# EAGLE design Version1.2 (EAGLE 9.6.2)
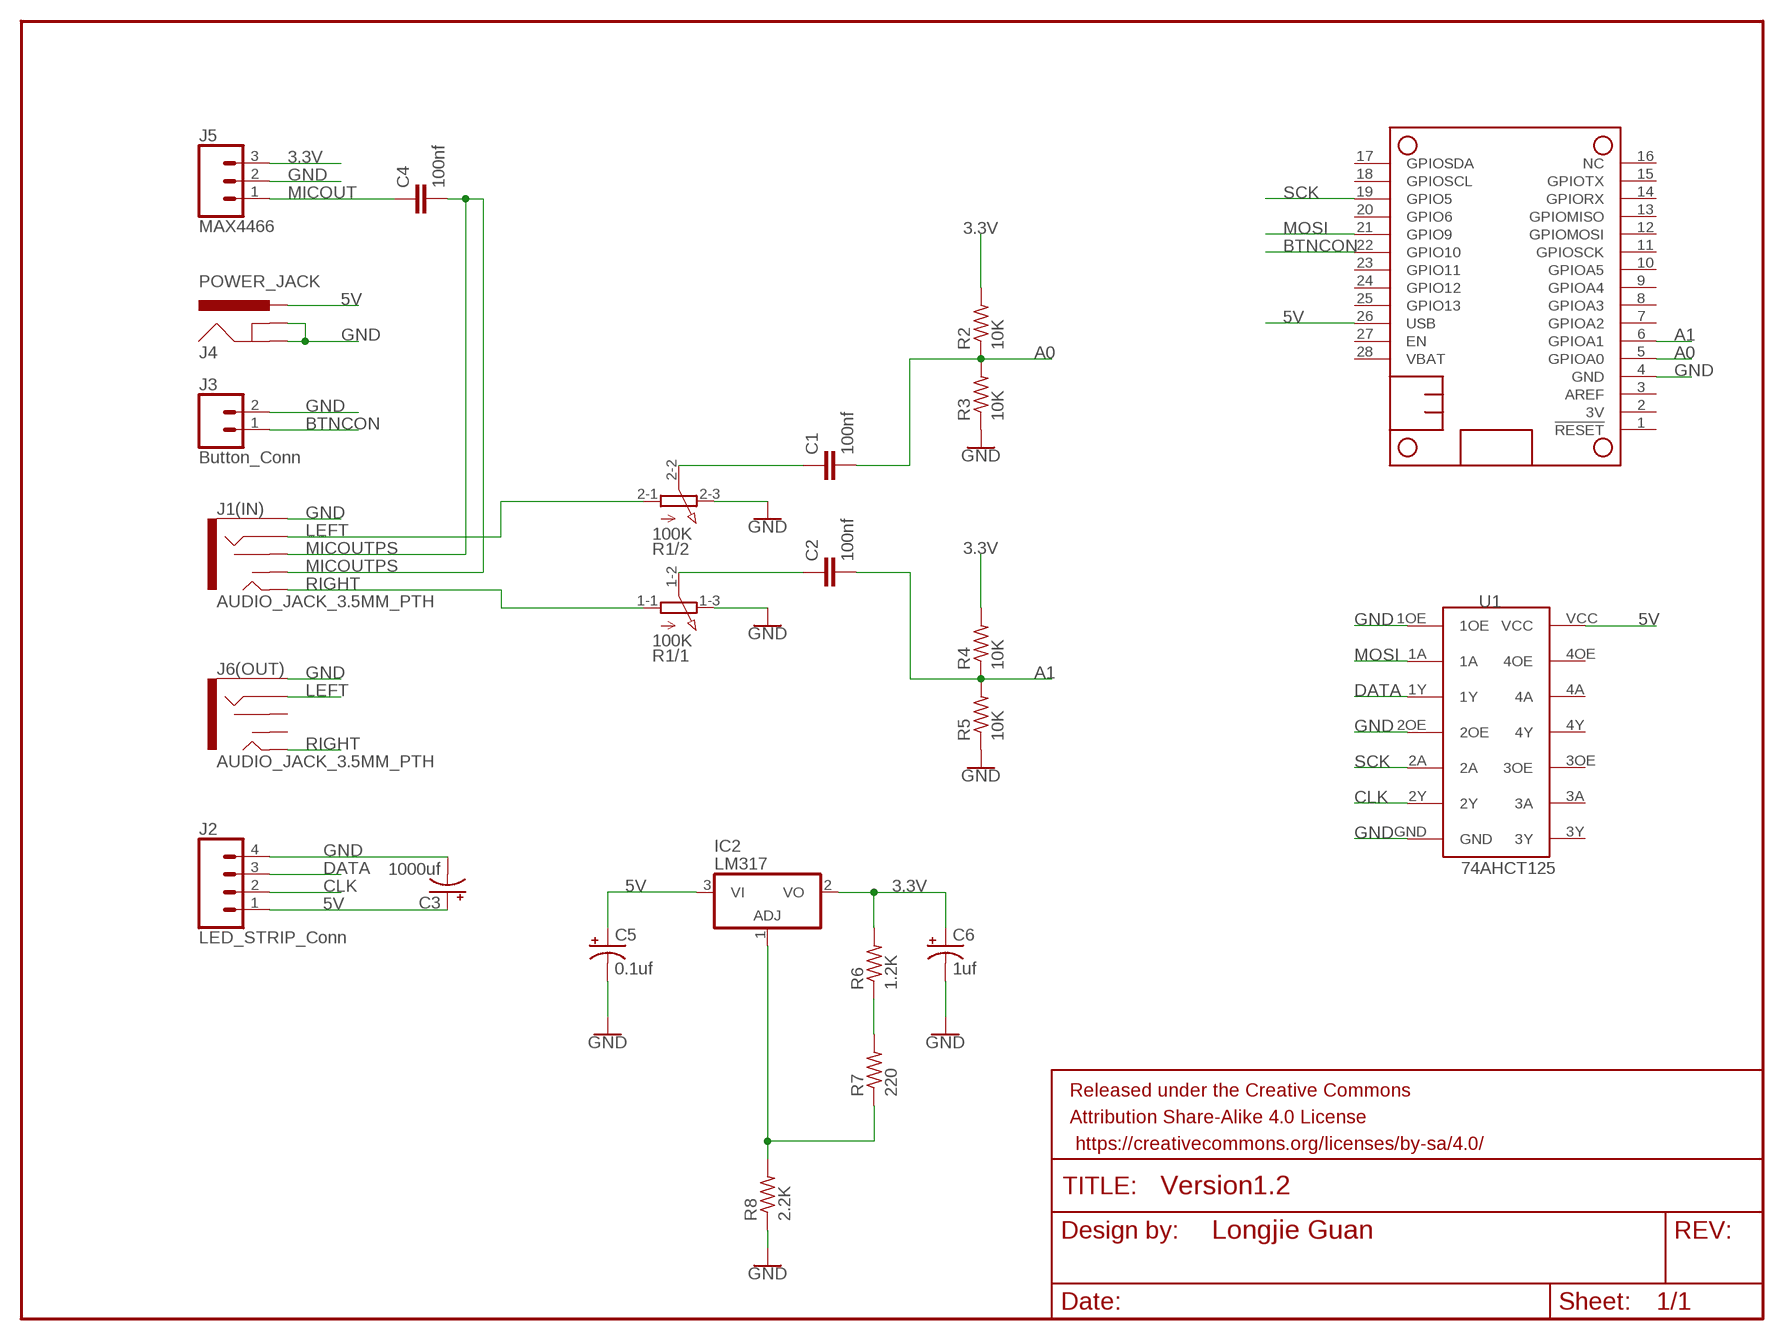
[diagram p0: schematic, sheet 1]

## Parts
C1  100nf  C2.5/2  [C2.5-2]
C2  100nf  C2.5/2  [C2.5-2]
C3  1000uf  CPOL-USB45181A  [B45181A]
C4  100nf  C2.5/2  [C2.5-2]
C5  0.1uf  CPOL-USB45181A  [B45181A]
C6  1uf  CPOL-USB45181A  [B45181A]
FRAME1  FRAME-LETTERNO_PACKAGE  [DUMMY]
IC2  LM317  317T  [TO220H]
J1(IN)  AUDIO_JACK_3.5MM_PTH  [AUDIO-JACK]
J2  LED_STRIP_Conn  CONN_04LOCK  [1X04_LOCK]
J3  Button_Conn  CONN_02  [1X02]
J4  POWER_JACK  [POWER_JACK_PTH]
J5  MAX4466  CONN_03  [1X03]
J6(OUT)  AUDIO_JACK_3.5MM_PTH  [AUDIO-JACK]
MS1  FEATHERWING_NODIM  [FEATHERWING_DIM]
R1  100K  3RP/1610G  [3RP/1610G]
R2  10K  R-US_0204/7  [0204/7]
R3  10K  R-US_0204/7  [0204/7]
R4  10K  R-US_0204/7  [0204/7]
R5  10K  R-US_0204/7  [0204/7]
R6  1.2K  R-US_0204/7  [0204/7]
R7  220  R-US_0204/7  [0204/7]
R8  2.2K  R-US_0204/7  [0204/7]
U1  74AHCT125  74AHCT125TH  [74AHCT125FP]

## Nets
3.3V: C6.+ IC2.2(VO) J5.3 R2.2 R4.2 R6.2
5V: C3.+ C5.+ IC2.3(VI) J2.1 J4.PWR MS1.26(USB) U1.VCC
A0: C1.2 MS1.5(GPIOA0) R2.1 R3.2
A1: C2.2 MS1.6(GPIOA1) R4.1 R5.2
BTNCON: J3.1 MS1.22(GPIO10)
CLK: J2.2 U1.2Y
DATA: J2.3 U1.1Y
GND: C3.- C5.- C6.- J1(IN).SLEEVE J2.4 J3.2 J4.GND J4.GNDBREAK J5.2 J6(OUT).SLEEVE MS1.4(GND) R1.1-3(/1:E) R1.2-3(/2:E) R3.1 R5.1 R8.1 U1.1OE U1.2OE U1.GND
LEFT: J1(IN).RING J6(OUT).RING R1.2-1(/2:A)
MICOUT: C4.1 J5.1
MICOUTPS: C4.2 J1(IN).RSH J1(IN).TSH
MOSI: MS1.21(GPIO9) U1.1A
N$2: C1.1 R1.2-2(/2:S)
N$3: C2.1 R1.1-2(/1:S)
N$5: R6.1 R7.2
N$6: IC2.1(ADJ) R7.1 R8.2
RIGHT: J1(IN).TIP J6(OUT).TIP R1.1-1(/1:A)
SCK: MS1.19(GPIO5) U1.2A
Unconnected: J6(OUT).RSH J6(OUT).TSH MS1.1(!RESET) MS1.2(3V) MS1.3(AREF) MS1.7(GPIOA2) MS1.8(GPIOA3) MS1.9(GPIOA4) MS1.10(GPIOA5) MS1.11(GPIOSCK) MS1.12(GPIOMOSI) MS1.13(GPIOMISO) MS1.14(GPIORX) MS1.15(GPIOTX) MS1.16(NC) MS1.17(GPIOSDA) MS1.18(GPIOSCL) MS1.20(GPIO6) MS1.23(GPIO11) MS1.24(GPIO12) MS1.25(GPIO13) MS1.27(EN) MS1.28(VBAT) U1.3A U1.3OE U1.3Y U1.4A U1.4OE U1.4Y

## Notes on the sheet
- Longjie Guan

## Library data of the parts
C1 C2 C4 = capacitor-wima:C: CAPACITOR naming: grid - package width
C3 C5 C6 = rcl:CPOL-US: POLARIZED CAPACITOR, American symbol; SPICEPREFIX: C
FRAME1 = SparkFun-Aesthetics:FRAME-LETTER: Schematic Frame - Letter Standard 8.5x11 US Letter frame; DESIGNER: Nobody; VERSION: v01
IC2 = linear:*317: Positive VOLTAGE REGULATOR
J1(IN) J6(OUT) = SparkFun-Connectors:AUDIO_JACK_3.5MM: Audio Jack 3.5mm variants of PTH and SMT stereo audio jack with bypass switches. SparkFun Products: SparkFun SparkPunk Sound Kit <[https://www.sparkfun.com/products/11177]> - PTH MP3 Trigger <https://www.sparkfun.com/products/13720> -3.5mm SMD SparkFun PicoBoard <https://www.sparkfun.com/products/11888>- 2.5mm SMD; PROD_ID: CONN-08774; SF_ID: PRT-08032
J2 = SparkFun-Connectors:CONN_04: Multi connection point. Often used as Generic Header-pin footprint for 0.1 inch spaced/style header connections On any of the 0.1 inch spaced packages, you can populate with these: Break Away Headers - Straight <https://www.sparkfun.com/products/116> (PRT-00116) Break Away Male Headers - Right Angle <https://www.sparkfun.com/products/553> (PRT-00553) Female Headers <https://www.sparkfun.com/products/115> (PRT-00115) Break Away Headers - Machine Pin <https://www.sparkfun.com/products/117> (PRT-00117) Break Away Female Headers - Swiss Machine Pin <https://www.sparkfun.com/products/743> (PRT-00743) For SCREWTERMINALS and SPRING TERMINALS visit here: Screw Terimnals on SparkFun.com <https://www.sparkfun.com/search/results?term=Screw+Terminals> (5mm/3.5mm/2.54mm spacing) This device is also useful as a general connection point to wire up your design to another part of your project. Our various solder wires solder well into these plated through hole pads. Hook-Up Wire - Assortment (Stranded, 22 AWG) <https://www.sparkfun.com/products/11375> (PRT-11375) Hook-Up Wire - Assortment (Solid Core, 22 AWG) <https://www.sparkfun.com/products/11367> (PRT-11367) View the entire wire category on our website here <https://www.sparkfun.com/categories/141> Special notes: Molex polarized connector foot print use with SKU : PRT-08231 with associated crimp pins and housings. 1MM SMD Version SKU: PRT-10208; PROD_ID: CONN-09696
J3 = SparkFun-Connectors:CONN_02: Multi connection point. Often used as Generic Header-pin footprint for 0.1 inch spaced/style header connections On any of the 0.1 inch spaced packages, you can populate with these: Break Away Headers - Straight <https://www.sparkfun.com/products/116> (PRT-00116) Break Away Male Headers - Right Angle <https://www.sparkfun.com/products/553> (PRT-00553) Female Headers <https://www.sparkfun.com/products/115> (PRT-00115) Break Away Headers - Machine Pin <https://www.sparkfun.com/products/117> (PRT-00117) Break Away Female Headers - Swiss Machine Pin <https://www.sparkfun.com/products/743> (PRT-00743) For SCREWTERMINALS and SPRING TERMINALS visit here: Screw Terimnals on SparkFun.com <https://www.sparkfun.com/search/results?term=Screw+Terminals> (5mm/3.5mm/2.54mm spacing) This device is also useful as a general connection point to wire up your design to another part of your project. Our various solder wires solder well into these plated through hole pads. Hook-Up Wire - Assortment (Stranded, 22 AWG) <https://www.sparkfun.com/products/11375> (PRT-11375) Hook-Up Wire - Assortment (Solid Core, 22 AWG) <https://www.sparkfun.com/products/11367> (PRT-11367) View the entire wire category on our website here <https://www.sparkfun.com/categories/141> Special notes: Molex polarized connector foot print use with: PRT-08233 with associated crimp pins and housings. 2.54_SCREWTERM for use with PRT-10571. 3.5mm Screw Terminal footprints for PRT-08084 5mm Screw Terminal footprints for use with PRT-08432
J4 = SparkFun-Connectors:POWER_JACK: Power Jack Connector This is the standard 5.5mm barrel jack for power. The PTH is the most common, proven, reliable, footprint. The Slot footprint only works if the mill layer is transmitted to the PCB fab house so be warned. Here are the connectors we sell at SparkFun: DC Barrel Power Jack/Connector <https://www.sparkfun.com/products/119> (PRT-00119) DC Barrel Power Jack/Connector (SMD) <https://www.sparkfun.com/products/12748> (PRT-12748) DC Barrel Jack Adapter - Breadboard Compatible <https://www.sparkfun.com/products/10811> (PRT-10811) It is used on this SparkFun product (and many, many others): SparkFun RedBoard - Programmed with Arduino <https://www.sparkfun.com/products/12757> (DEV-12757) Also, if you need a mating power supply or connector, please check these out: Wall Adapter Power Supply - 9VDC 650mA <https://www.sparkfun.com/products/298> (TOL-00298) DC Barrel Jack Adapter - Male <https://www.sparkfun.com/products/10287> (PRT-10287); PROD_ID: CONN-08197
J5 = SparkFun-Connectors:CONN_03: Multi connection point. Often used as Generic Header-pin footprint for 0.1 inch spaced/style header connections On any of the 0.1 inch spaced packages, you can populate with these: Break Away Headers - Straight <https://www.sparkfun.com/products/116> (PRT-00116) Break Away Male Headers - Right Angle <https://www.sparkfun.com/products/553> (PRT-00553) Female Headers <https://www.sparkfun.com/products/115> (PRT-00115) Break Away Headers - Machine Pin <https://www.sparkfun.com/products/117> (PRT-00117) Break Away Female Headers - Swiss Machine Pin <https://www.sparkfun.com/products/743> (PRT-00743) Stackable Header - 3 Pin (Female, 0.1") <https://www.sparkfun.com/products/13875> (PRT-13875) For SCREWTERMINALS and SPRING TERMINALS visit here: Screw Terimnals on SparkFun.com <https://www.sparkfun.com/search/results?term=Screw+Terminals> (5mm/3.5mm/2.54mm spacing) This device is also useful as a general connection point to wire up your design to another part of your project. Our various solder wires solder well into these plated through hole pads. Hook-Up Wire - Assortment (Stranded, 22 AWG) <https://www.sparkfun.com/products/11375> (PRT-11375) Hook-Up Wire - Assortment (Solid Core, 22 AWG) <https://www.sparkfun.com/products/11367> (PRT-11367) View the entire wire category on our website here <https://www.sparkfun.com/categories/141> Special notes: Molex polarized connector foot print use with SKU : PRT-08232 with associated crimp pins and housings.; PROD_ID: XXX-00000; VALUE: 455-1750-1-ND
MS1 = adafruit:FEATHERWING
R1 = pot:3RP/1610G: 16mm Potentiometer two level Source: http://www.alphapotentiometers.net/html/16mm_pot_2.html
R2-R8 = rcl:R-US_: RESISTOR, American symbol; SPICEPREFIX: R
U1 = CreatedSymbol:74AHCT125

## Board
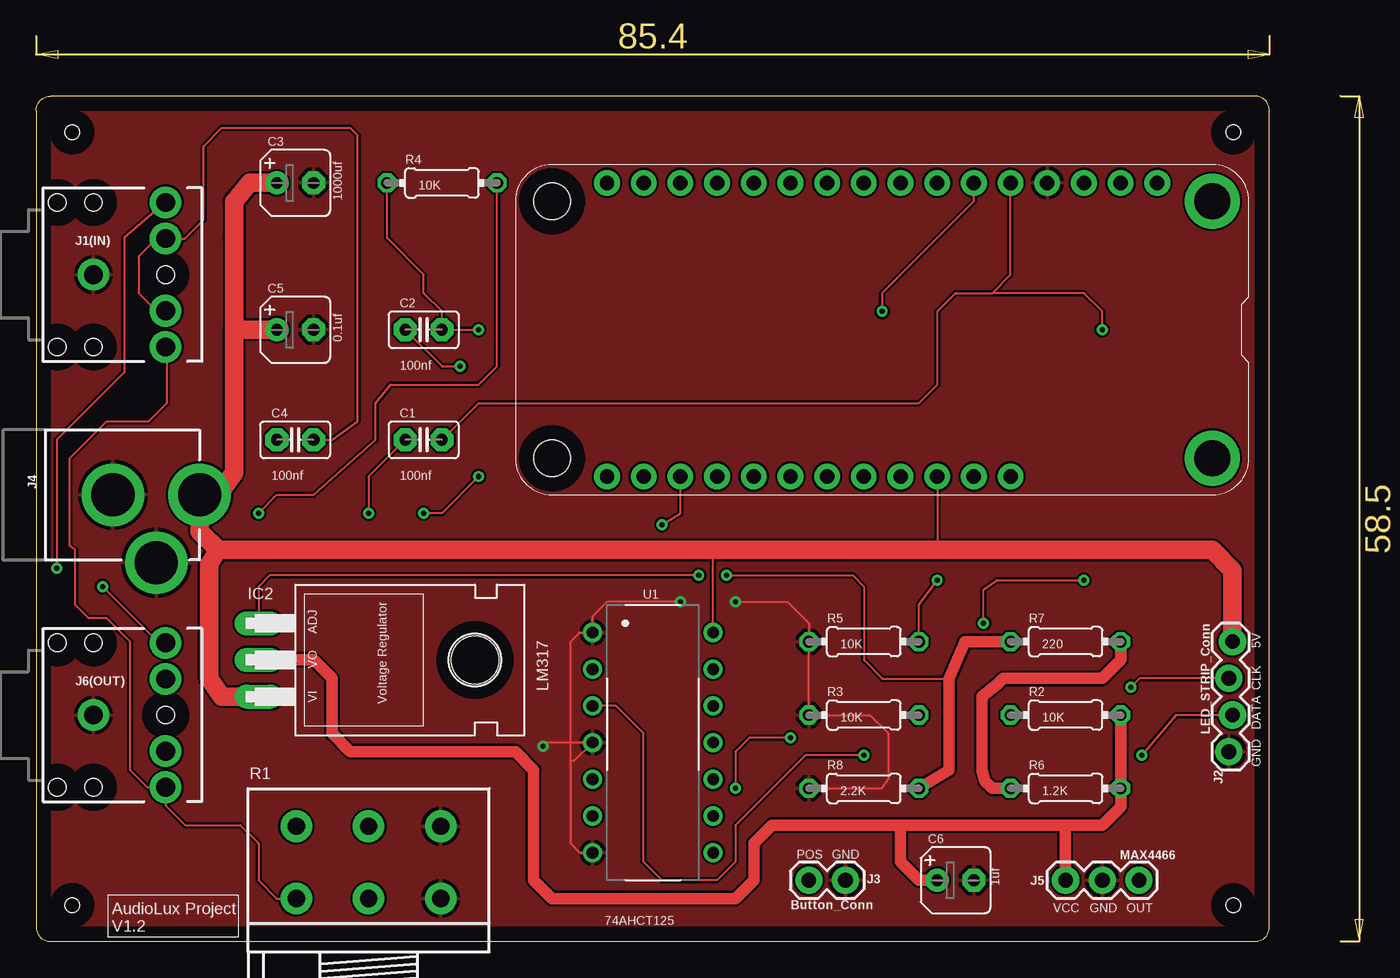
[diagram p1: board, top side]
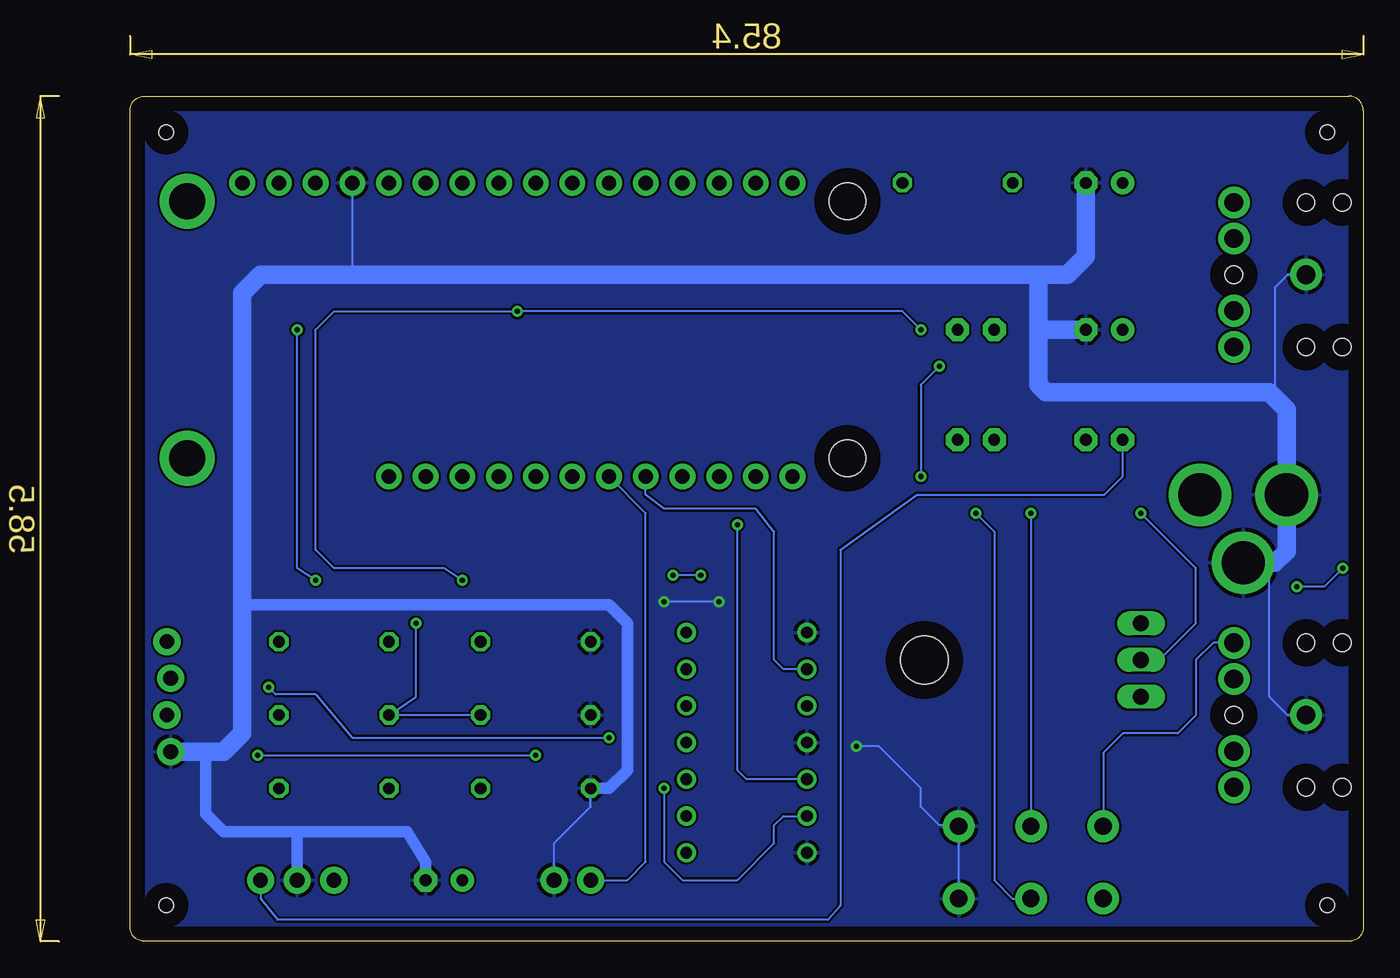
[diagram p2: board, bottom side, seen from below]

Size 85.4 x 58.5 mm. Coordinates in mm from the lower left corner, seen from the top.
Outline: 85.4,1 85.4,57.5 arc90 84.4,58.5 1,58.5 arc90 0,57.5 0,1 arc90 1,0 84.4,0 arc90 85.4,1
Copper layers (1*16): Top 0.035mm / dielectric 1.5mm / Bottom 0.035mm
Design rules "default": minimum track width 6mil, minimum drill 0.35mm, track to track 6mil, track to pad 6mil, pad to pad 6mil, via to via 6mil, smd to smd 6mil, copper to edge 40mil, drill to drill 6mil, minimum pad ring 10mil, minimum via ring 8mil, stop-mask expansion 4mil, vias tented up to drill 0mil, thermal gap 10mil
Holes 1 mm at 82.9,56 82.9,2.5 2.5,56 2.5,2.5

### Footprints (pad centres in the part's own frame; a part is rotated, then mirrored left to right if it is on the bottom)
C2.5-2 = drill 0.813 pad 1.6 octagon: 1 -1.27,0; 2 1.27,0
B45181A = drill 0.813 pad 1.6: + -1.27,0 | drill 0.813 pad 1.6 octagon: - 1.27,0
TO220H = drill 1.118 long: 1 -2.54,-10.16; 2 0,-10.16; 3 2.54,-10.16 | hole 3.302: 0,4.826
AUDIO-JACK = drill 1.3 pad 2.184: RING 5,5; RSH 5,2.5; SLEEVE 0,0; TIP 5,-5; TSH 5,-2.5 | hole 1.2: 0,5; -2.5,5; -2.5,-5; 0,-5; 5,0
1X04_LOCK = drill 1.016 pad 1.88: 1 0,0.127; 2 2.54,-0.127; 3 5.08,0.127; 4 7.62,-0.127
1X02 = drill 1.016 pad 1.88: 1 0,0; 2 2.54,0
POWER_JACK_PTH = drill 2.997 pad 4.318: GND 0,7.7; GNDBREAK 4.7,10.7; PWR 0,13.7
1X03 = drill 1.016 pad 1.88: 1 0,0; 2 2.54,0; 3 5.08,0
FEATHERWING_DIM = drill 1 pad 1.778: 1 6.35,1.27; 2 8.89,1.27; 3 11.43,1.27; 4 13.97,1.27; 5 16.51,1.27; 6 19.05,1.27; 7 21.59,1.27; 8 24.13,1.27; 9 26.67,1.27; 10 29.21,1.27; 11 31.75,1.27; 12 34.29,1.27; 13 36.83,1.27; 14 39.37,1.27; 15 41.91,1.27; 16 44.45,1.27; 17 44.45,21.59; 18 41.91,21.59; 19 39.37,21.59; 20 36.83,21.59; 21 34.29,21.59; 22 31.75,21.59; 23 29.21,21.59; 24 26.67,21.59; 25 24.13,21.59; 26 21.59,21.59; 27 19.05,21.59; 28 16.51,21.59 | drill 2.5 pad 3.81: P$1 2.54,20.32; P$2 2.54,2.54 | hole 2.54: 48.26,20.32; 48.26,2.54
3RP/1610G = drill 1.2 pad 2.184: 1-1 -5,0; 1-2 0,0; 1-3 5,0; 2-1 -5,5; 2-2 0,5; 2-3 5,5
0204/7 = drill 0.813 octagon: 1 -3.81,0; 2 3.81,0
74AHCT125FP = drill 0.813: 1A 18.05,10.79; 1OE 18.05,13.33; 1Y 18.05,8.25; 2A 18.05,3.17; 2OE 18.05,5.71; 2Y 18.05,0.63; 3A 26.4,0.63; 3OE 26.4,3.17; 3Y 26.4,-1.91; 4A 26.4,8.25; 4OE 26.4,10.79; 4Y 26.4,5.71; GND 18.05,-1.91; VCC 26.4,13.33

### Placement (x,y rotation side)
C1  26.83,34.72 0 top
C2  26.83,42.34 0 top
C3  17.94,52.5 0 top
C4  17.94,34.72 0 top
C5  17.94,42.34 0 top
C6  63.66,4.24 0 top
FRAME1  -2.38,-9.73 0 top  (outside the outline)
IC2  25.56,19.48 270 top
J1(IN)  3.97,46.15 0 top
J2  82.71,20.75 270 top
J3  53.5,4.24 0 top
J4  -2.38,30.91 270 top
J5  76.36,4.24 180 top
J6(OUT)  3.97,15.67 0 top
MS1  83.98,53.77 180 top
R1  23.02,2.97 0 top
R2  71.28,15.67 0 top
R3  57.31,15.67 0 top
R4  28.1,52.5 0 top
R5  57.31,20.75 0 top
R6  71.28,10.59 0 top
R7  71.28,20.75 0 top
R8  57.31,10.59 0 top
U1  20.48,8.05 0 top

### Tracks (layer width: path | path; a pad name or v marks a point on that pad's centre or on a via)
3.3V  (via drill 0.35)
  Top 0.152: v15.4,29.64 16.67,30.91 19.21,30.91 23.5,34.72 23.5,37.26 24.53,38.53 30.64,38.53 31.91,39.8 R4.2
  Top 0.813: 71.28,8.05 73.82,8.05 75.09,9.32 R6.2 R2.2 | 71.28,8.05 59.85,8.05 | 59.85,8.05 50.96,8.05 49.69,6.78 49.69,4.24 48.42,2.97 35.72,2.97 34.45,4.24 34.45,11.86 33.18,13.13 21.75,13.13 20.48,14.4 20.48,18.21 19.21,19.48 IC2.2 | C6.+ 61.12,4.24 59.85,5.51 59.85,8.05 | J5.3 71.28,8.05
  Bottom 0.152: IC2.2 14.13,19.48 11.59,22.02 11.59,25.83 v15.4,29.64
5V
  Top 0.152: MS1.26 62.39,27.1 | U1.VCC 46.88,26.83 47.15,27.1
  Top 1.27: J2.1 82.84,25.7 81.44,27.1 62.39,27.1 47.15,27.1 12.59,27.1 | 12.59,27.1 11.32,28.37 J4.PWR 12.59,30.91 13.7,32.45 13.7,42.34 | 13.7,42.34 13.7,48.69 13.7,51.2 14.8,52.5 C3.+ | IC2.3 12.86,16.94 12,18.21 12,26.1 12.59,27.1 | C5.+ 13.7,42.34
A0  (via drill 0.35)
  Top 0.152: C1.2 30.64,37.26 61.12,37.26 62.39,38.53 62.39,43.61 63.66,44.88 66.2,44.88 | 66.2,44.88 67.47,46.15 MS1.5 | v73.82,42.34 73.82,43.61 72.55,44.88 66.2,44.88 | v72.55,25 66.51,25 65.6,24.34 v65.6,22.02
  Bottom 0.152: v65.6,22.02 65.6,16.94 R2.1 R3.2 | v72.55,25 73.82,25.83 v73.82,42.34
A1  (via drill 0.35)
  Top 0.152: R4.1 24.29,48.69 26.83,46.15 26.83,44.88 28.1,43.61 C2.2 v30.64,42.34 | MS1.6 64.93,51.23 58.58,44.88 v58.58,43.61 | R5.2 61.12,23.29 v62.39,25
  Bottom 0.152: v30.64,42.34 31.91,43.61 v58.58,43.61 71.28,43.61 72.55,42.34 72.55,27.1 71.28,25.83 63.66,25.83 v62.39,25
BTNCON
  Bottom 0.152: J3.1 50.96,4.24 49.69,5.51 49.69,29.64 MS1.22
CLK  (via drill 0.35)
  Top 0.152: v48.42,10.59 48.42,13.13 49.39,14.1 v52.23,14.1 | v75.8,17.6 76.41,18.21 J2.2
  Bottom 0.152: v52.23,14.1 70.01,14.1 72.55,17.1 75.3,17.1 v75.8,17.6 | v48.42,10.59 48.42,5.51 47.15,4.24 43.34,4.24 40.8,6.78 40.8,8.05 40.17,8.68 U1.2Y
DATA  (via drill 0.35)
  Top 0.152: v76.55,12.9 78.9,15.67 J2.3 | U1.1Y 40.17,16.3 42.07,14.4 42.07,5.51 43.34,4.24 47.15,4.24 48.42,5.51 48.42,8.05 52.23,11.86 53.27,12.9 v57.31,12.9
  Bottom 0.152: v76.55,12.9 v57.31,12.9
GND  (via drill 0.35)
  Top 0.152: 36.99,12.49 37.26,12.49 U1.2OE 35.36,13.76 v35.1,13.5 | 36.99,12.49 36.99,6.78 37.63,6.14 U1.GND | 36.99,12.49 36.99,20.75 37.62,21.38 U1.1OE 38.53,22.5 39.53,23.5 v44.61,23.5 | R8.1 58.58,10.59 59,11.22 59,14.4 57.73,15.67 R3.1 R5.1 53.5,22.02 52.02,23.5 v48.42,23.5
  Bottom 0.152: 6.14,37.63 6.14,45.25 5.24,46.15 J1(IN).SLEEVE | J6(OUT).SLEEVE 5.24,15.67 6.51,16.94 6.51,25.83 6.13,26.21 | R1.1-3 R1.2-3 28.1,8.05 29.37,8.05 30.64,9.32 30.64,10.59 33.55,13.5 v35.1,13.5 | J3.2 56.04,6.78 53.5,9.32 R8.1 | v44.61,23.5 v48.42,23.5 | MS1.4 70.01,46.15
  Bottom 0.813: R8.1 52.23,10.59 50.96,11.86 50.96,22.02 52.23,23.29 77.63,23.29 | C6.- 64.93,5.51 66.2,7.58 73.82,7.58 | 73.82,7.58 78.9,7.58 80.17,8.85 80.17,13.13 | J5.2 73.82,7.58
  Bottom 1.27: C3.- 19.21,47.42 20.48,46.15 22.5,46.15 | J2.4 80.17,13.13 78.9,13.13 77.63,14.4 77.63,23.29 77.63,44.88 76.36,46.15 70.01,46.15 22.5,46.15 | J4.GNDBREAK 6.13,26.21 5.32,27.02 J4.GND 5.32,36.81 6.14,37.63 6.51,38 21.97,38 22.5,38.53 22.5,42.34 | 22.5,46.15 22.5,42.34 | C5.- 22.5,42.34
  pour Bottom (isolate 0.001): 0,58.5 85.4,58.5 85.4,0 0,0
  pour Top (isolate 0.001): 0,58.5 85.4,58.5 85.4,0 0,0
LEFT  (via drill 0.35)
  Top 0.152: J1(IN).RING 6.1,48.69 6.1,39.39 1.43,34.72 v1.43,25.83 | J6(OUT).RING 8.49,20.67 v4.6,24.56
  Bottom 0.152: v1.43,25.83 2.7,24.56 v4.6,24.56 | J6(OUT).RING 10.4,20.67 11.59,19.48 11.59,15.67 12.86,14.4 16.67,14.4 18.02,13.05 R1.2-1
MICOUT
  Bottom 0.152: J5.1 76.36,2.97 75.19,1.5 37.08,1.5 36.22,2.47 36.22,27.1 30.91,30.91 17.94,30.91 16.67,32.18 C4.1
MICOUTPS
  Top 0.152: C4.2 20.48,34.72 22.25,35.99 22.25,55.81 21.75,56.31 12.86,56.31 11.59,55.04 11.59,49.96 10.28,48.65 J1(IN).RSH 8.33,48.65 7.1,47.42 7.1,44.88 8.33,43.65 J1(IN).TSH
MOSI
  Bottom 0.152: U1.1A 40.16,18.84 40.8,19.48 40.8,28.37 42.07,29.94 48.42,29.94 49.69,30.91 MS1.21
N$2  (via drill 0.35)
  Top 0.152: C1.1 23.02,32.18 v23.02,29.64
  Bottom 0.152: v23.02,29.64 R1.2-2
N$3  (via drill 0.35)
  Top 0.152: C2.1 28.1,39.8 v29.37,39.8 | v30.64,32.18 28.1,29.64 v26.83,29.64
  Bottom 0.152: v29.37,39.8 30.64,38.53 v30.64,32.18 | v26.83,29.64 25.56,28.37 25.56,4.24 24.29,2.97 R1.1-2
N$5
  Top 0.813: R7.2 75.09,19.48 73.82,18.21 66.97,18.21 66.58,17.82 65.5,16.94 65.5,11.86 65.7,11.09 66.2,10.59 R6.1
N$6  (via drill 0.35)
  Top 0.152: v45.88,25.33 16.17,25.33 15.4,24.56 IC2.1 | v47.8,25.33 56.54,25.33 57.31,24.56 57.31,19.48 58.6,18.19 63.2,18.19
  Top 0.813: R7.1 64.3,20.75 63.2,18.19 63.2,11.86 R8.2
  Bottom 0.152: v45.88,25.33 v47.8,25.33
RIGHT
  Top 0.152: J1(IN).TIP 9.05,41.07 9.05,37.26 7.78,35.99 4.88,35.99 2.3,33.41 2.3,27.4 2.7,27.1 2.7,23.29 3.63,22.36 4.9,22.36 6.51,20.75 6.51,11.86 7.7,10.67 J6(OUT).TIP 8.97,9.4 10.32,8.05 14.13,8.05 15.4,6.78 15.4,4.24 16.67,2.97 R1.1-1
SCK  (via drill 0.35)
  Top 0.152: v43.34,28.85 44.61,29.64 MS1.19
  Bottom 0.152: U1.2A 42.7,11.22 43.34,11.86 v43.34,28.85

### Text on the board
tPlace: ADJ | 5V | VO | VI | CLK | Voltage Regulator | DATA | GND | POS | GND | VCC | GND | OUT | AudioLux Project / V1.2